# Altium schematic sheet F28335_AddOn_Memory.SchDoc
size Letter; DocumentNumber: 7; SheetNumber: 7; SheetTotal: 9
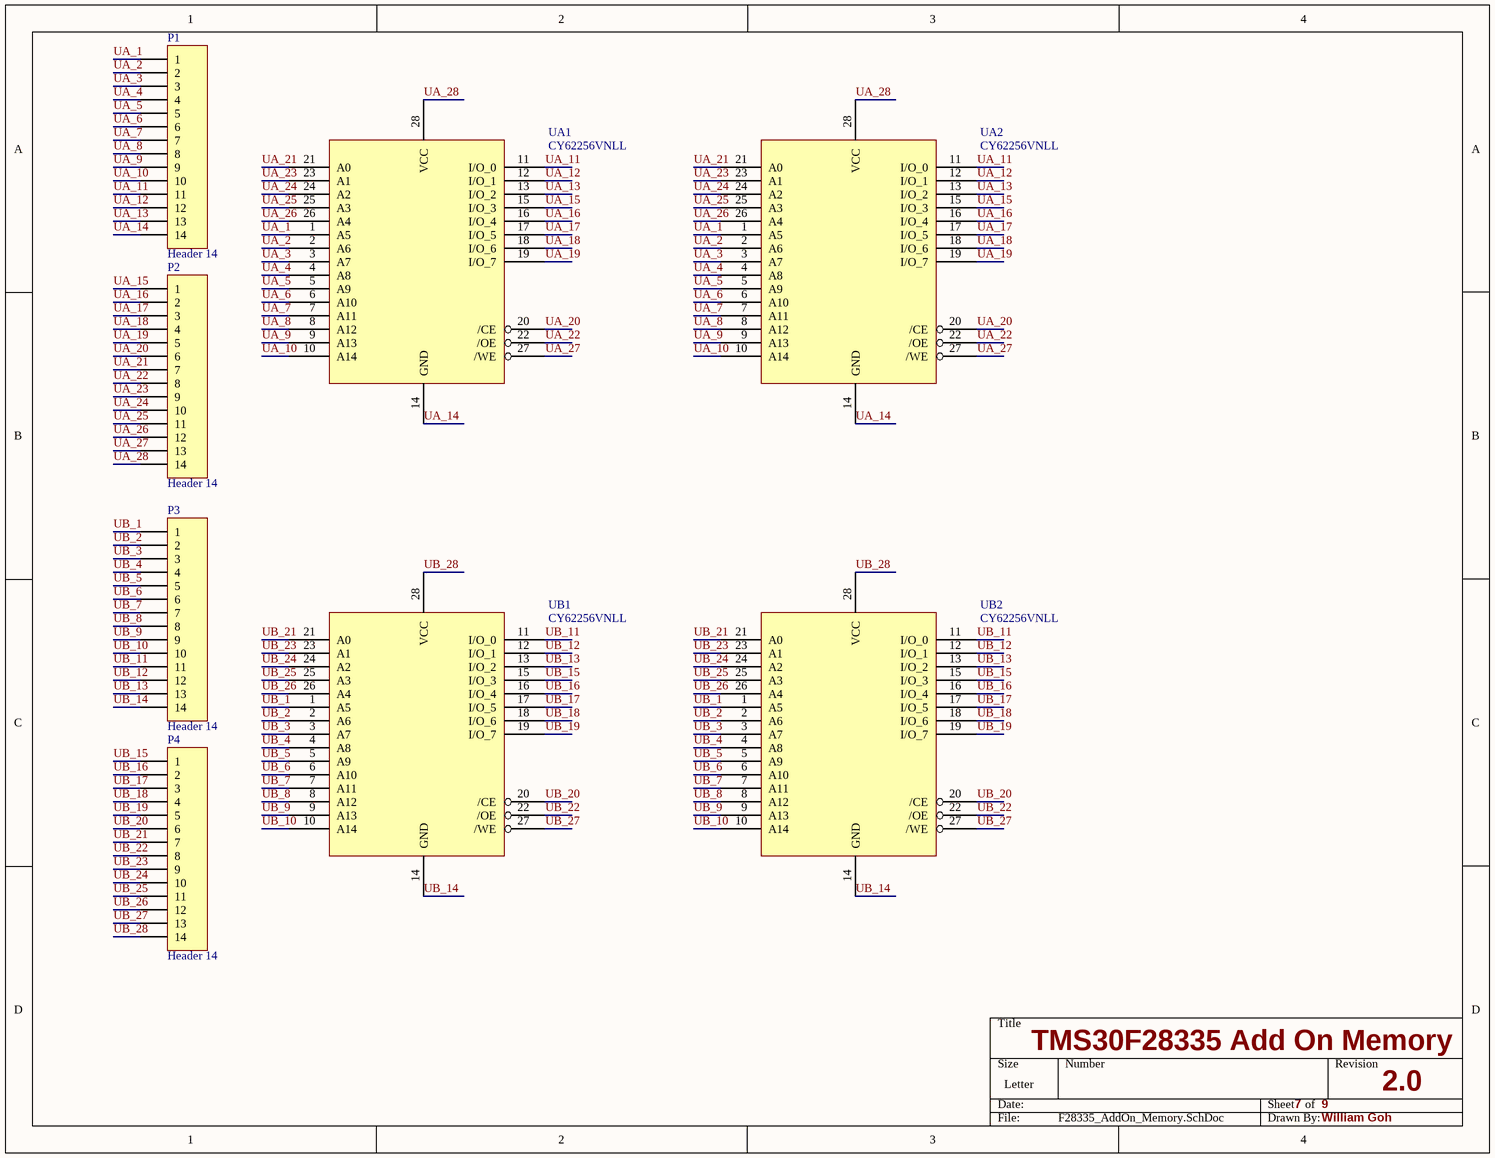
[diagram p0: F28335_AddOn_Memory.SchDoc]

## Parts
P1  Header 14  [HDR1X14]
P2  Header 14  [HDR1X14]
P3  Header 14  [HDR1X14]
P4  Header 14  [HDR1X14]
UA1  CY62256VNLL  [28-SOIC CY62256VNLL]
UA2  CY62256VNLL  [28-TSSOP CY62256VNLL]
UB1  CY62256VNLL  [28-SOIC CY62256VNLL]
UB2  CY62256VNLL  [28-TSSOP CY62256VNLL]

## Nets
UA_1: P1.1 UA1.1(A5) UA2.1(A5)
UA_2: P1.2 UA1.2(A6) UA2.2(A6)
UA_3: P1.3 UA1.3(A7) UA2.3(A7)
UA_4: P1.4 UA1.4(A8) UA2.4(A8)
UA_5: P1.5 UA1.5(A9) UA2.5(A9)
UA_6: P1.6 UA1.6(A10) UA2.6(A10)
UA_7: P1.7 UA1.7(A11) UA2.7(A11)
UA_8: P1.8 UA1.8(A12) UA2.8(A12)
UA_9: P1.9 UA1.9(A13) UA2.9(A13)
UA_10: P1.10 UA1.10(A14) UA2.10(A14)
UA_11: P1.11 UA1.11(I/O_0) UA2.11(I/O_0)
UA_12: P1.12 UA1.12(I/O_1) UA2.12(I/O_1)
UA_13: P1.13 UA1.13(I/O_2) UA2.13(I/O_2)
UA_14: P1.14 UA1.14(GND) UA2.14(GND)
UA_15: P2.1 UA1.15(I/O_3) UA2.15(I/O_3)
UA_16: P2.2 UA1.16(I/O_4) UA2.16(I/O_4)
UA_17: P2.3 UA1.17(I/O_5) UA2.17(I/O_5)
UA_18: P2.4 UA1.18(I/O_6) UA2.18(I/O_6)
UA_19: P2.5 UA1.19(I/O_7) UA2.19(I/O_7)
UA_20: P2.6 UA1.20(/CE) UA2.20(/CE)
UA_21: P2.7 UA1.21(A0) UA2.21(A0)
UA_22: P2.8 UA1.22(/OE) UA2.22(/OE)
UA_23: P2.9 UA1.23(A1) UA2.23(A1)
UA_24: P2.10 UA1.24(A2) UA2.24(A2)
UA_25: P2.11 UA1.25(A3) UA2.25(A3)
UA_26: P2.12 UA1.26(A4) UA2.26(A4)
UA_27: P2.13 UA1.27(/WE) UA2.27(/WE)
UA_28: P2.14 UA1.28(VCC) UA2.28(VCC)
UB_1: P3.1 UB1.1(A5) UB2.1(A5)
UB_2: P3.2 UB1.2(A6) UB2.2(A6)
UB_3: P3.3 UB1.3(A7) UB2.3(A7)
UB_4: P3.4 UB1.4(A8) UB2.4(A8)
UB_5: P3.5 UB1.5(A9) UB2.5(A9)
UB_6: P3.6 UB1.6(A10) UB2.6(A10)
UB_7: P3.7 UB1.7(A11) UB2.7(A11)
UB_8: P3.8 UB1.8(A12) UB2.8(A12)
UB_9: P3.9 UB1.9(A13) UB2.9(A13)
UB_10: P3.10 UB1.10(A14) UB2.10(A14)
UB_11: P3.11 UB1.11(I/O_0) UB2.11(I/O_0)
UB_12: P3.12 UB1.12(I/O_1) UB2.12(I/O_1)
UB_13: P3.13 UB1.13(I/O_2) UB2.13(I/O_2)
UB_14: P3.14 UB1.14(GND) UB2.14(GND)
UB_15: P4.1 UB1.15(I/O_3) UB2.15(I/O_3)
UB_16: P4.2 UB1.16(I/O_4) UB2.16(I/O_4)
UB_17: P4.3 UB1.17(I/O_5) UB2.17(I/O_5)
UB_18: P4.4 UB1.18(I/O_6) UB2.18(I/O_6)
UB_19: P4.5 UB1.19(I/O_7) UB2.19(I/O_7)
UB_20: P4.6 UB1.20(/CE) UB2.20(/CE)
UB_21: P4.7 UB1.21(A0) UB2.21(A0)
UB_22: P4.8 UB1.22(/OE) UB2.22(/OE)
UB_23: P4.9 UB1.23(A1) UB2.23(A1)
UB_24: P4.10 UB1.24(A2) UB2.24(A2)
UB_25: P4.11 UB1.25(A3) UB2.25(A3)
UB_26: P4.12 UB1.26(A4) UB2.26(A4)
UB_27: P4.13 UB1.27(/WE) UB2.27(/WE)
UB_28: P4.14 UB1.28(VCC) UB2.28(VCC)

## Notes on the sheet
- TMS30F28335 Add On Memory
- 2.0
- William Goh

## Library data of the parts
P1-P4 = Header 14: Header, 14-Pin; LatestRevisionDate: 17-Jul-2002; LatestRevisionNote: Re-released for DXP Platform.; Publisher: Altium Limited
UA1 UA2 UB1 UB2 = CY62256VNLL: Cypress SRAM 256KB 3.3V; Digikey #: 428-2001-5-ND; Digikey #: 428-2085-ND